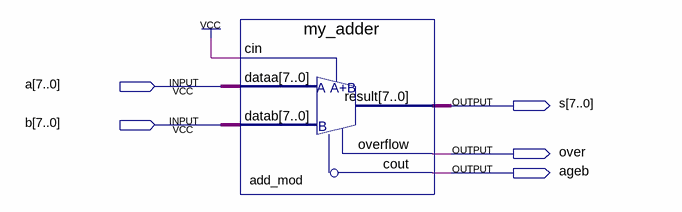
[diagram p0: schematic sheet]
// Quartus schematic adder_mod.bdf as structural Verilog: 1 symbols, 5 pins
module adder_mod (
  input  [7:0] a,
  input  [7:0] b,
  output [7:0] s,
  output over,
  output ageb
);

  wire add_mod_cout;

  my_adder add_mod (.cin(1'b1), .dataa(a), .datab(b), .cout(add_mod_cout), .overflow(over), .result(s));
  not add_mod_cout_inverted (ageb, add_mod_cout);
endmodule
